# EAGLE design SNES_MultiOut_2 (EAGLE 9.0.0)
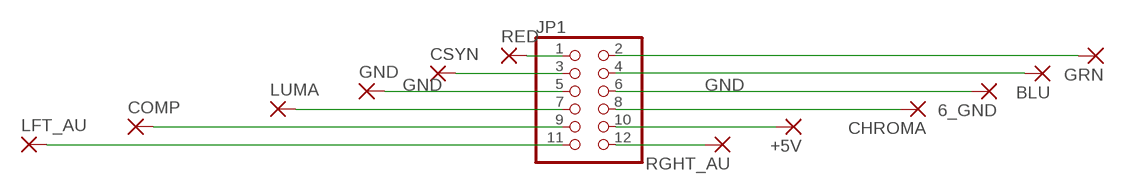
[diagram p0: schematic, sheet 1]

## Parts
6_GND  SMD2  [SMD1,27-2,54]
+5V  SMD2  [SMD1,27-2,54]
BLU  SMD2  [SMD1,27-2,54]
CHROMA  SMD2  [SMD1,27-2,54]
COMP  SMD2  [SMD1,27-2,54]
CSYN  SMD2  [SMD1,27-2,54]
GND  SMD2  [SMD1,27-2,54]
GRN  SMD2  [SMD1,27-2,54]
JP1  PINHD-2X06_2.54  [2X06]
LFT_AU  SMD2  [SMD1,27-2,54]
LUMA  SMD2  [SMD1,27-2,54]
RED  SMD2  [SMD1,27-2,54]
RGHT_AU  SMD2  [SMD1,27-2,54]

## Nets
+5V: +5V.1(P) JP1.10
AUDIO_LEFT: JP1.11 LFT_AU.1(P)
AUDIO_RIGHT: JP1.12 RGHT_AU.1(P)
BLUE: BLU.1(P) JP1.4
CHROMA: CHROMA.1(P) JP1.8
COMPOSITE: COMP.1(P) JP1.9
CSYNC: CSYN.1(P) JP1.3
GND: 6_GND.1(P) GND.1(P) JP1.5 JP1.6
GREEN: GRN.1(P) JP1.2
LUMA: JP1.7 LUMA.1(P)
RED: JP1.1 RED.1(P)

## Library data of the parts
6_GND +5V BLU CHROMA COMP CSYN GND GRN LFT_AU LUMA RED RGHT_AU = wirepad:SMD2: SMD PAD
JP1 = pinhead-2:PINHD-2X06: PIN HEADER

## Board
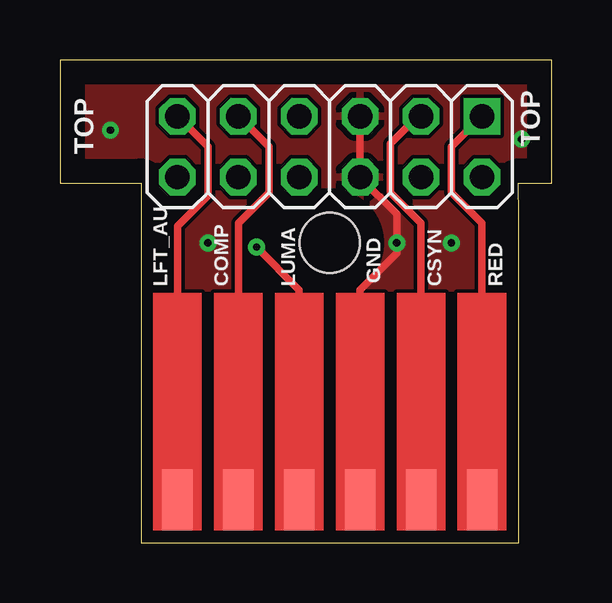
[diagram p1: board, top side]
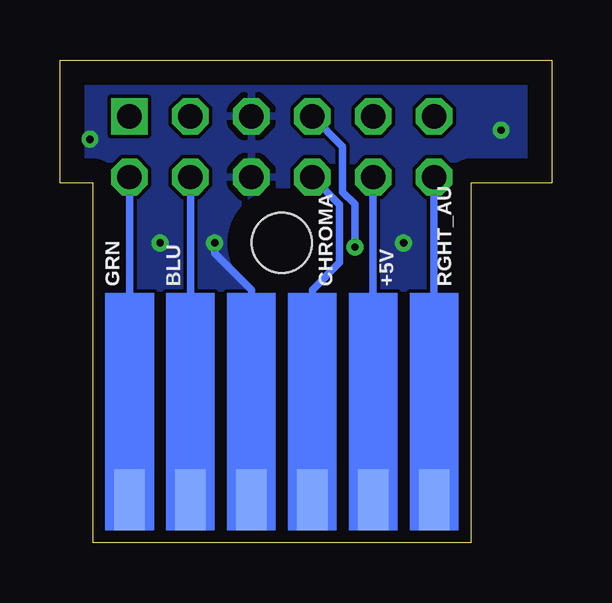
[diagram p2: board, bottom side, seen from below]

Size 20.5 x 20.13 mm. Coordinates in mm from the lower left corner, seen from the top.
Outline: 3.38,0 19.12,0 19.12,13.59 19.12,15 20.5,15 20.5,20.13 0,20.13 0,15 3.38,15 3.38,0
Copper layers (1*16): Top 0.035mm / dielectric 1.5mm / Bottom 0.035mm
Design rules "default": minimum track width 6mil, minimum drill 0.35mm, track to track 6mil, track to pad 6mil, pad to pad 6mil, via to via 6mil, smd to smd 6mil, copper to edge 40mil, drill to drill 6mil, minimum pad ring 10mil, minimum via ring 8mil, stop-mask expansion 4mil, vias tented up to drill 0mil, thermal gap 10mil
Holes 2.5 mm at 11.25,12.5

### Footprints (pad centres in the part's own frame; a part is rotated, then mirrored left to right if it is on the bottom)
SMD1,27-2,54 = smd 1.27 x 2.54: 1 0,0
2X06 = drill 1.016 square: 1 -6.35,-1.27 | drill 1.016 octagon: 2 -6.35,1.27; 3 -3.81,-1.27; 4 -3.81,1.27; 5 -1.27,-1.27; 6 -1.27,1.27; 7 1.27,-1.27; 8 1.27,1.27; 9 3.81,-1.27; 10 3.81,1.27; 11 6.35,-1.27; 12 6.35,1.27

### Placement (x,y rotation side)
6_GND  12.52,1.78 0 bottom
+5V  7.44,1.78 0 bottom
BLU  15.06,1.78 0 bottom
CHROMA  9.98,1.78 0 bottom
COMP  7.44,1.78 0 top
CSYN  15.06,1.78 0 top
GND  12.52,1.78 0 top
GRN  17.6,1.78 0 bottom
JP1  11.25,16.51 180 top
LFT_AU  4.9,1.78 0 top
LUMA  9.98,1.78 0 top
RED  17.6,1.78 0 top
RGHT_AU  4.9,1.78 0 bottom

### Tracks (layer width: path | path; a pad name or v marks a point on that pad's centre or on a via)
+5V
  Bottom 0.305: +5V.1 JP1.10
AUDIO_LEFT
  Top 0.305: LFT_AU.1 4.9,13.21 6.17,14.48 6.17,16.51 JP1.11
AUDIO_RIGHT
  Bottom 0.305: RGHT_AU.1 JP1.12
BLUE
  Bottom 0.305: BLU.1 JP1.4
CHROMA
  Bottom 0.305: CHROMA.1 9.98,10.54 8.84,11.68 8.84,14.1 JP1.8
COMPOSITE
  Top 0.305: JP1.9 8.71,16.51 8.71,14.61 7.44,13.34 COMP.1
CSYNC
  Top 0.305: JP1.3 14.93,17.78 13.79,16.64 13.79,14.61 15.06,13.34 CSYN.1
GND  (via drill 0.3)
  Top 0.305: JP1.5 JP1.6 12.52,15.23 14.04,13.7 v14.04,12.5 | 6_GND.1 12.52,10.54 14.04,12.06 v14.04,12.5 | 14.04,12.88 v14.04,12.5
  Bottom 0.305: 6_GND.1 12.52,10.54 14.04,12.06 v14.04,12.5
  other vias: 6.17,12.5 16.33,12.5 2.1,17.2 19.25,16.82
  pour Top: 2.99,9.91 2.99,14.61 -0.05,14.61 -0.05,20.19 20.52,20.19 20.52,14.61 19.5,14.61 19.5,9.91
  pour Bottom: -0.05,20.19 20.52,20.19 20.52,14.61 19.5,14.61 19.5,9.91 2.99,9.91 2.99,14.61 -0.05,14.61
GREEN
  Bottom 0.305: GRN.1 JP1.2
LUMA  (via drill 0.3)
  Top 0.305: LUMA.1 9.98,10.54 v8.2,12.32
  Bottom 0.305: JP1.7 8.71,16.51 8.71,14.62 8.2,14.11 v8.2,12.32
RED
  Top 0.305: JP1.1 16.33,16.51 16.33,14.61 17.6,13.34 RED.1
(copper drawn outside any net)
  shapes: Bottom area x6, Top area x6

### Text on the board
tNames: TOP | TOP